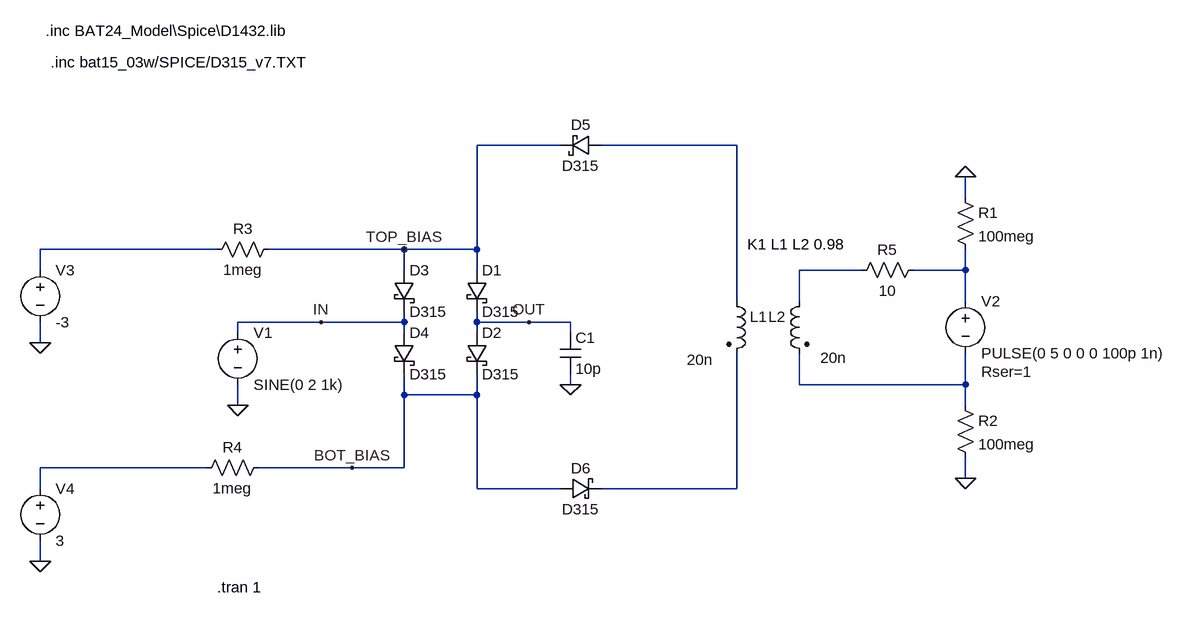
[diagram p0: schematic diode_bridge.asc]
diode_bridge.asc, the LTspice schematic file:
Version 4
SHEET 1 2100 680
WIRE 416 -112 288 -112
WIRE 688 -112 480 -112
WIRE 1040 -32 1040 -64
WIRE -112 48 -384 48
WIRE 176 48 -32 48
WIRE 288 48 288 -112
WIRE 288 48 176 48
WIRE -384 80 -384 48
WIRE 176 80 176 48
WIRE 288 80 288 48
WIRE 880 80 784 80
WIRE 1040 80 1040 48
WIRE 1040 80 960 80
WIRE 688 128 688 -112
WIRE 784 128 784 80
WIRE 1040 128 1040 80
WIRE 48 160 -80 160
WIRE 176 160 176 144
WIRE 176 160 48 160
WIRE 288 160 288 144
WIRE 368 160 288 160
WIRE 432 160 368 160
WIRE -80 176 -80 160
WIRE 176 176 176 160
WIRE 288 176 288 160
WIRE 432 176 432 160
WIRE -384 192 -384 160
WIRE 432 256 432 240
WIRE 784 256 784 208
WIRE 1040 256 1040 208
WIRE 1040 256 784 256
WIRE 176 272 176 240
WIRE 288 272 288 240
WIRE 288 272 176 272
WIRE -80 288 -80 256
WIRE 1040 288 1040 256
WIRE -128 384 -384 384
WIRE 96 384 -48 384
WIRE 176 384 176 272
WIRE 176 384 96 384
WIRE 1040 400 1040 368
WIRE -384 416 -384 384
WIRE 288 416 288 272
WIRE 416 416 288 416
WIRE 688 416 688 208
WIRE 688 416 480 416
WIRE -384 528 -384 496
FLAG -384 192 0
FLAG -384 528 0
FLAG 368 160 OUT
FLAG 48 160 IN
FLAG 432 256 0
FLAG 176 48 TOP_BIAS
FLAG 96 384 BOT_BIAS
FLAG 1040 400 0
FLAG 1040 -64 0
FLAG -80 288 0
SYMBOL voltage -384 64 R0
WINDOW 123 0 0 Left 2
WINDOW 39 0 0 Left 2
SYMATTR InstName V3
SYMATTR Value -3
SYMBOL voltage -384 400 R0
WINDOW 123 0 0 Left 2
WINDOW 39 0 0 Left 2
SYMATTR InstName V4
SYMATTR Value 3
SYMBOL res -16 32 R90
WINDOW 0 0 56 VBottom 2
WINDOW 3 32 56 VTop 2
SYMATTR InstName R3
SYMATTR Value 1meg
SYMBOL res -32 368 R90
WINDOW 0 0 56 VBottom 2
WINDOW 3 32 56 VTop 2
SYMATTR InstName R4
SYMATTR Value 1meg
SYMBOL ind2 672 112 R0
WINDOW 3 -61 106 Left 2
SYMATTR Value 20n
SYMATTR InstName L1
SYMATTR Type ind
SYMBOL ind2 800 112 M0
WINDOW 3 -57 103 Left 2
SYMATTR Value 20n
SYMATTR InstName L2
SYMATTR Type ind
SYMBOL cap 416 176 R0
SYMATTR InstName C1
SYMATTR Value 10p
SYMBOL voltage 1040 112 R0
WINDOW 123 0 0 Left 2
WINDOW 39 24 124 Left 2
SYMATTR SpiceLine Rser=1
SYMATTR InstName V2
SYMATTR Value PULSE(0 5 0 0 0 100p 1n)
SYMBOL res 1024 -48 R0
SYMATTR InstName R1
SYMATTR Value 100meg
SYMBOL res 1024 272 R0
SYMATTR InstName R2
SYMATTR Value 100meg
SYMBOL schottky 160 80 R0
SYMATTR InstName D3
SYMATTR Value D315
SYMATTR Description Diode
SYMATTR Type diode
SYMATTR Prefix X
SYMBOL schottky 272 80 R0
SYMATTR InstName D1
SYMATTR Value D315
SYMATTR Description Diode
SYMATTR Type diode
SYMATTR Prefix X
SYMBOL schottky 272 176 R0
SYMATTR InstName D2
SYMATTR Value D315
SYMATTR Description Diode
SYMATTR Type diode
SYMATTR Prefix X
SYMBOL schottky 160 176 R0
SYMATTR InstName D4
SYMATTR Value D315
SYMATTR Description Diode
SYMATTR Type diode
SYMATTR Prefix X
SYMBOL voltage -80 160 R0
WINDOW 123 0 0 Left 2
WINDOW 39 24 124 Left 2
SYMATTR InstName V1
SYMATTR Value SINE(0 2 1k)
SYMBOL schottky 480 -128 R90
WINDOW 0 0 32 VBottom 2
WINDOW 3 32 32 VTop 2
SYMATTR InstName D5
SYMATTR Value D315
SYMATTR Description Diode
SYMATTR Type diode
SYMATTR Prefix X
SYMBOL schottky 416 432 R270
WINDOW 0 32 32 VTop 2
WINDOW 3 0 32 VBottom 2
SYMATTR InstName D6
SYMATTR Value D315
SYMATTR Description Diode
SYMATTR Type diode
SYMATTR Prefix X
SYMBOL res 976 64 R90
WINDOW 0 0 56 VBottom 2
WINDOW 3 32 56 VTop 2
SYMATTR InstName R5
SYMATTR Value 10
TEXT -112 568 Left 2 !.tran 1
TEXT 704 40 Left 2 !K1 L1 L2 0.98
TEXT -376 -288 Left 2 !.inc BAT24_Model\\Spice\\D1432.lib
TEXT -368 -240 Left 2 !.inc bat15_03w/SPICE/D315_v7.TXT

The netlist it stands for:
* diode_bridge.asc
V3 N002 0 -3
V4 N006 0 3
R3 TOP_BIAS N002 1meg
R4 BOT_BIAS N006 1meg
L1 N001 N007 20n
L2 N003 N005 20n
C1 OUT 0 10p
V2 N004 N005 PULSE(0 5 0 0 0 100p 1n) Rser=1
R1 0 N004 100meg
R2 N005 0 100meg
XD3 TOP_BIAS IN D315  ; pins + -
XD1 TOP_BIAS OUT D315  ; pins + -
XD2 OUT BOT_BIAS D315  ; pins + -
XD4 IN BOT_BIAS D315  ; pins + -
V1 IN 0 SINE(0 2 1k)
XD5 N001 TOP_BIAS D315  ; pins + -
XD6 BOT_BIAS N007 D315  ; pins + -
R5 N004 N003 10
.tran 1
K1 L1 L2 0.98
.inc BAT24_Model\Spice\D1432.lib
.inc bat15_03w/SPICE/D315_v7.TXT
.backanno
.end